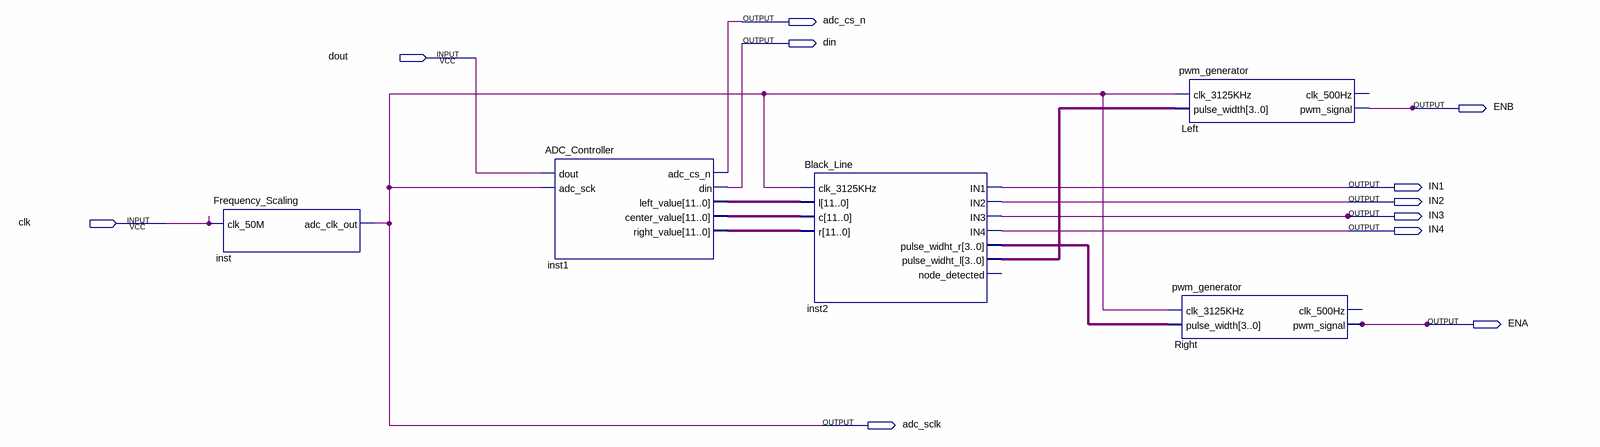
[diagram p0: schematic sheet]
// Quartus schematic Black_line_following.bdf as structural Verilog: 5 symbols, 11 pins
module Black_line_following (
  input  dout,
  input  clk,
  output adc_cs_n,
  output din,
  output ENB,
  output IN1,
  output IN2,
  output IN3,
  output IN4,
  output ENA,
  output adc_sclk
);

  wire [3:0] inst2_pulse_widht_l, inst2_pulse_widht_r;
  wire [11:0] inst1_center_value, inst1_left_value, inst1_right_value;

  Frequency_Scaling inst (.clk_50M(clk), .adc_clk_out(adc_sclk));
  ADC_Controller inst1 (
    .dout(dout), .adc_sck(adc_sclk), .adc_cs_n(adc_cs_n), .din(din), .left_value(inst1_left_value),
    .center_value(inst1_center_value), .right_value(inst1_right_value));
  Black_Line inst2 (
    .clk_3125KHz(adc_sclk), .l(inst1_left_value), .c(inst1_center_value), .r(inst1_right_value), .IN1(IN1),
    .IN2(IN2), .IN3(IN3), .IN4(IN4), .pulse_widht_r(inst2_pulse_widht_r), .pulse_widht_l(inst2_pulse_widht_l));  // open: node_detected
  pwm_generator Right (.clk_3125KHz(adc_sclk), .pulse_width(inst2_pulse_widht_r), .pwm_signal(ENA));  // open: clk_500Hz
  pwm_generator Left (.clk_3125KHz(adc_sclk), .pulse_width(inst2_pulse_widht_l), .pwm_signal(ENB));  // open: clk_500Hz
endmodule
